# EAGLE design 4current_2te (EAGLE 6.4)
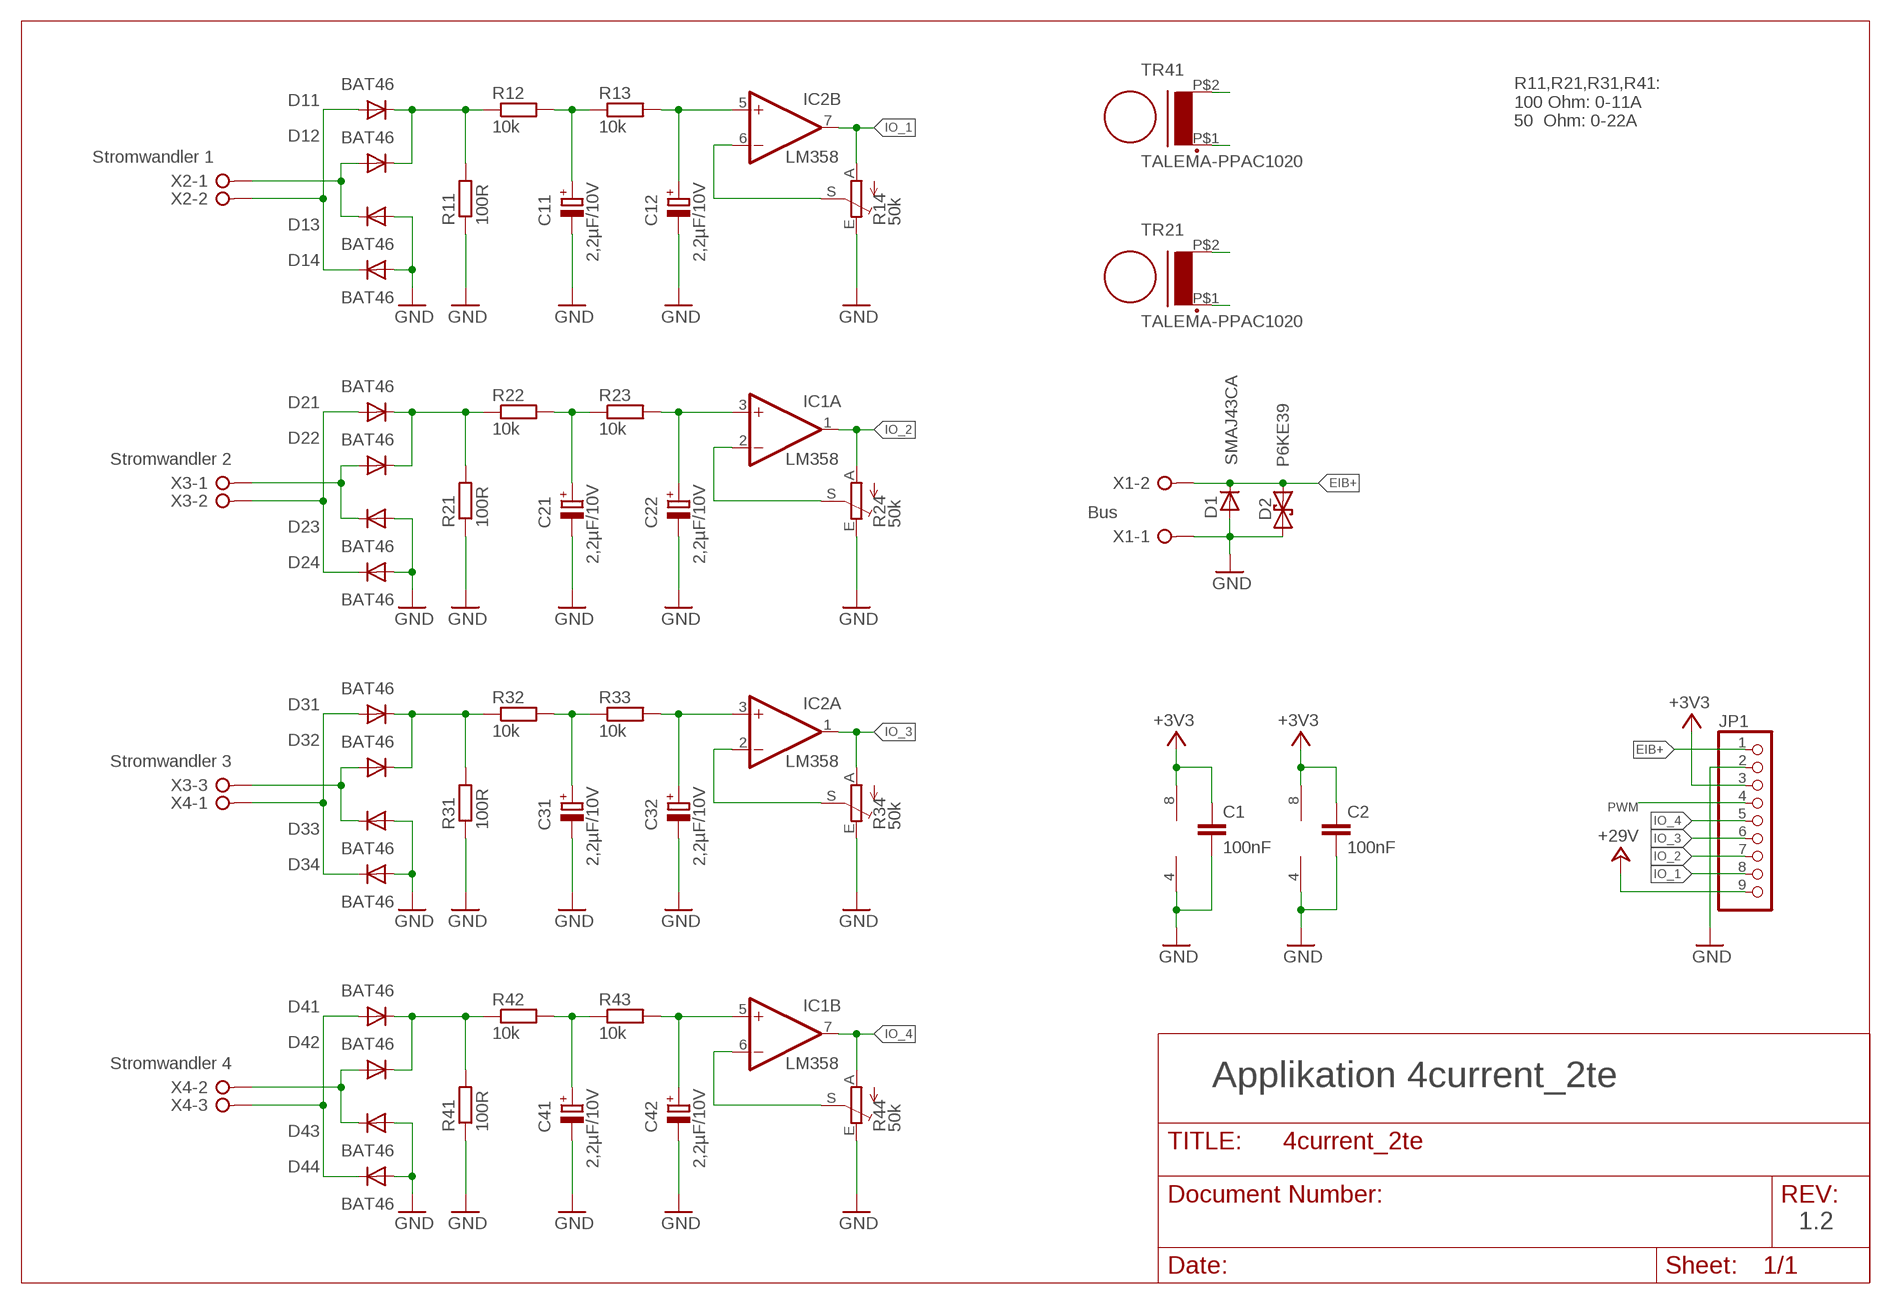
[diagram p0: schematic, sheet 1]

## Parts
C1  100nF  C-EU025-024X044  [C025-024X044]
C2  100nF  C-EU025-024X044  [C025-024X044]
C11  2,2µF/10V  CPOL-EUE2-5  [E2-5]
C12  2,2µF/10V  CPOL-EUE2-5  [E2-5]
C21  2,2µF/10V  CPOL-EUE2-5  [E2-5]
C22  2,2µF/10V  CPOL-EUE2-5  [E2-5]
C31  2,2µF/10V  CPOL-EUE2-5  [E2-5]
C32  2,2µF/10V  CPOL-EUE2-5  [E2-5]
C41  2,2µF/10V  CPOL-EUE2-5  [E2-5]
C42  2,2µF/10V  CPOL-EUE2-5  [E2-5]
D1  SMAJ43CA  D-SOD-87  [SOD87]
D2  P6KE39  P6KEXXCDO41-7  [DO41-7]
D11  BAT46  1N4148DO35-7  [DO35-7]
D12  BAT46  1N4148DO35-7  [DO35-7]
D13  BAT46  1N4148DO35-7  [DO35-7]
D14  BAT46  1N4148DO35-7  [DO35-7]
D21  BAT46  1N4148DO35-7  [DO35-7]
D22  BAT46  1N4148DO35-7  [DO35-7]
D23  BAT46  1N4148DO35-7  [DO35-7]
D24  BAT46  1N4148DO35-7  [DO35-7]
D31  BAT46  1N4148DO35-7  [DO35-7]
D32  BAT46  1N4148DO35-7  [DO35-7]
D33  BAT46  1N4148DO35-7  [DO35-7]
D34  BAT46  1N4148DO35-7  [DO35-7]
D41  BAT46  1N4148DO35-7  [DO35-7]
D42  BAT46  1N4148DO35-7  [DO35-7]
D43  BAT46  1N4148DO35-7  [DO35-7]
D44  BAT46  1N4148DO35-7  [DO35-7]
IC1  LM358  LM358N  [DIL08]
IC2  LM358  LM358N  [DIL08]
JP1  PINHD-1X9  [1X09]
R11  100R  R-EU_0204/7  [0204/7]
R12  10k  R-EU_0204/7  [0204/7]
R13  10k  R-EU_0204/7  [0204/7]
R14  50k  TRIM_EU-B64W  [B64W]
R21  100R  R-EU_0204/7  [0204/7]
R22  10k  R-EU_0204/7  [0204/7]
R23  10k  R-EU_0204/7  [0204/7]
R24  50k  TRIM_EU-B64W  [B64W]
R31  100R  R-EU_0204/7  [0204/7]
R32  10k  R-EU_0204/7  [0204/7]
R33  10k  R-EU_0204/7  [0204/7]
R34  50k  TRIM_EU-B64W  [B64W]
R41  100R  R-EU_0204/7  [0204/7]
R42  10k  R-EU_0204/7  [0204/7]
R43  10k  R-EU_0204/7  [0204/7]
R44  50k  TRIM_EU-B64W  [B64W]
TR21  TALEMA-PPAC1020  [TALEMA_AC]
TR41  TALEMA-PPAC1020  [TALEMA_AC]
X1  W237-02P  [W237-132]
X2  W237-02P  [W237-132]
X3  W237-3E  [W237-3E]
X4  W237-3E  [W237-3E]

## Nets
+3V3: C1.1 C2.1 IC1.8(P:V+) IC2.8(P:V+) JP1.3
+29V: JP1.9
EIB+: D1.1(C) D2.C JP1.1 X1.2
GND: C1.2 C2.2 C11.- C12.- C21.- C22.- C31.- C32.- C41.- C42.- D1.2(A) D2.A D13.A D14.A D23.A D24.A D33.A D34.A D43.A D44.A IC1.4(P:V-) IC2.4(P:V-) JP1.2 R11.1 R14.E R21.1 R24.E R31.1 R34.E R41.1 R44.E X1.1
IO_1: IC2.7(B:OUT) JP1.8 R14.A
IO_2: IC1.1(A:OUT) JP1.7 R24.A
IO_3: IC2.1(A:OUT) JP1.6 R34.A
IO_4: IC1.7(B:OUT) JP1.5 R44.A
N$1: D21.C D22.C R21.2 R22.1
N$2: C21.+ R22.2 R23.1
N$3: C22.+ IC1.3(A:+IN) R23.2
N$4: IC1.2(A:-IN) R24.S
N$5: D31.C D32.C R31.2 R32.1
N$6: C31.+ R32.2 R33.1
N$7: C32.+ IC2.3(A:+IN) R33.2
N$9: D41.C D42.C R41.2 R42.1
N$10: C41.+ R42.2 R43.1
N$11: D11.C D12.C R11.2 R12.1
N$12: C42.+ IC1.5(B:+IN) R43.2
N$13: IC1.6(B:-IN) R44.S
N$14: C11.+ R12.2 R13.1
N$15: C12.+ IC2.5(B:+IN) R13.2
N$16: IC2.2(A:-IN) R34.S
N$18: IC2.6(B:-IN) R14.S
PWM: JP1.4
SENSOR01: TR41.P$2(S4)
SENSOR1_A: D12.A D13.C X2.1
SENSOR1_B: D11.A D14.C X2.2
SENSOR02: TR41.P$1(S3)
SENSOR2_A: D22.A D23.C X3.1
SENSOR2_B: D21.A D24.C X3.2
SENSOR03: TR21.P$2(S4)
SENSOR3_A: D32.A D33.C X3.3
SENSOR3_B: D31.A D34.C X4.1
SENSOR04: TR21.P$1(S3)
SENSOR4_A: D42.A D43.C X4.2
SENSOR4_B: D41.A D44.C X4.3

## Notes on the sheet
- R11,R21,R31,R41:
  100 Ohm: 0-11A
  50  Ohm: 0-22A
- Stromwandler 1
- Stromwandler 2
- Bus
- Stromwandler 3
- Stromwandler 4
- Applikation 4current_2te
- 1.2

## Library data of the parts
C1 C2 = rcl:C-EU: CAPACITOR, European symbol
C11 C12 C21 C22 C31 C32 C41 C42 = rcl:CPOL-EU: POLARIZED CAPACITOR, European symbol
D1 = semicon-smd-ipc:D-: DIODE unfilled
D2 = diode:P6KEXXC: DIODE transient-voltage suppressor
D11-D14 D21-D24 D31-D34 D41-D44 = diode:1N4148: DIODE high speed (Philips)
IC1 IC2 = linear:LM358: OP AMP also LM158; LM258; LM2904 Source: http://cache.national.com/ds/LM/LM158.pdf
JP1 = pinhead:PINHD-1X9: PIN HEADER
R11-R13 R21-R23 R31-R33 R41-R43 = rcl:R-EU_: RESISTOR, European symbol
R14 R24 R34 R44 = pot:TRIM_EU-: POTENTIOMETER
TR21 TR41 = Uwe:TALEMA-PPAC1020
X1 X2 = con-wago-508:W237-02P: WAGO SREW CLAMP; OC_FARNELL: unknown; OC_NEWARK: unknown
X3 X4 = con-wago-508:W237-3E: WAGO SREW CLAMP; OC_FARNELL: unknown; OC_NEWARK: unknown

## Board
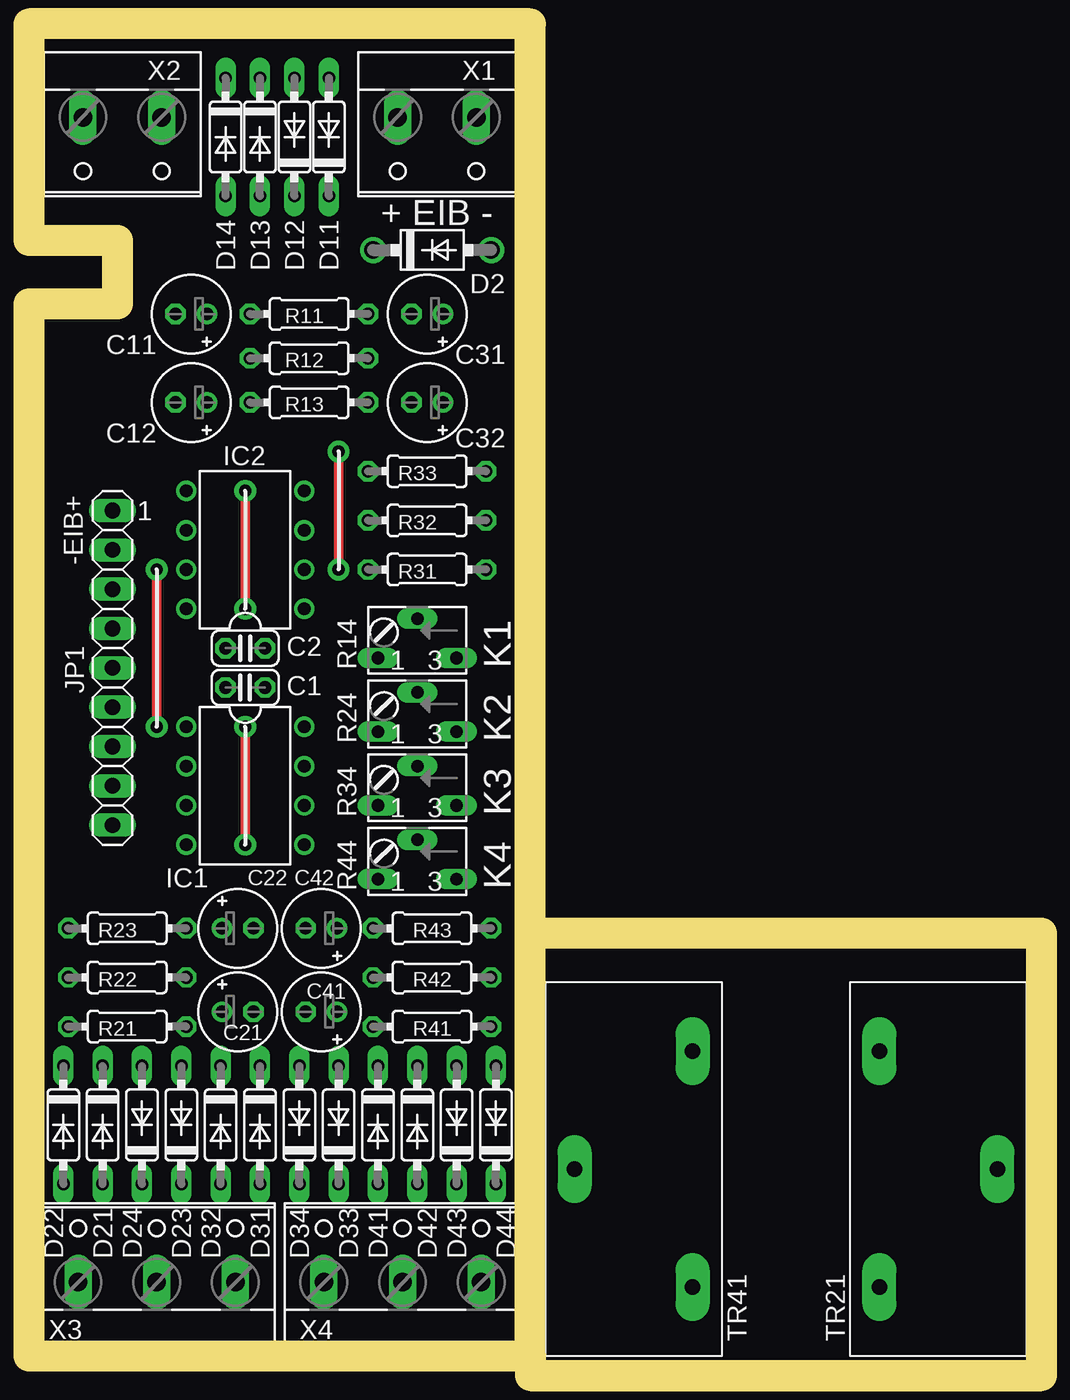
[diagram p1: board, top side]
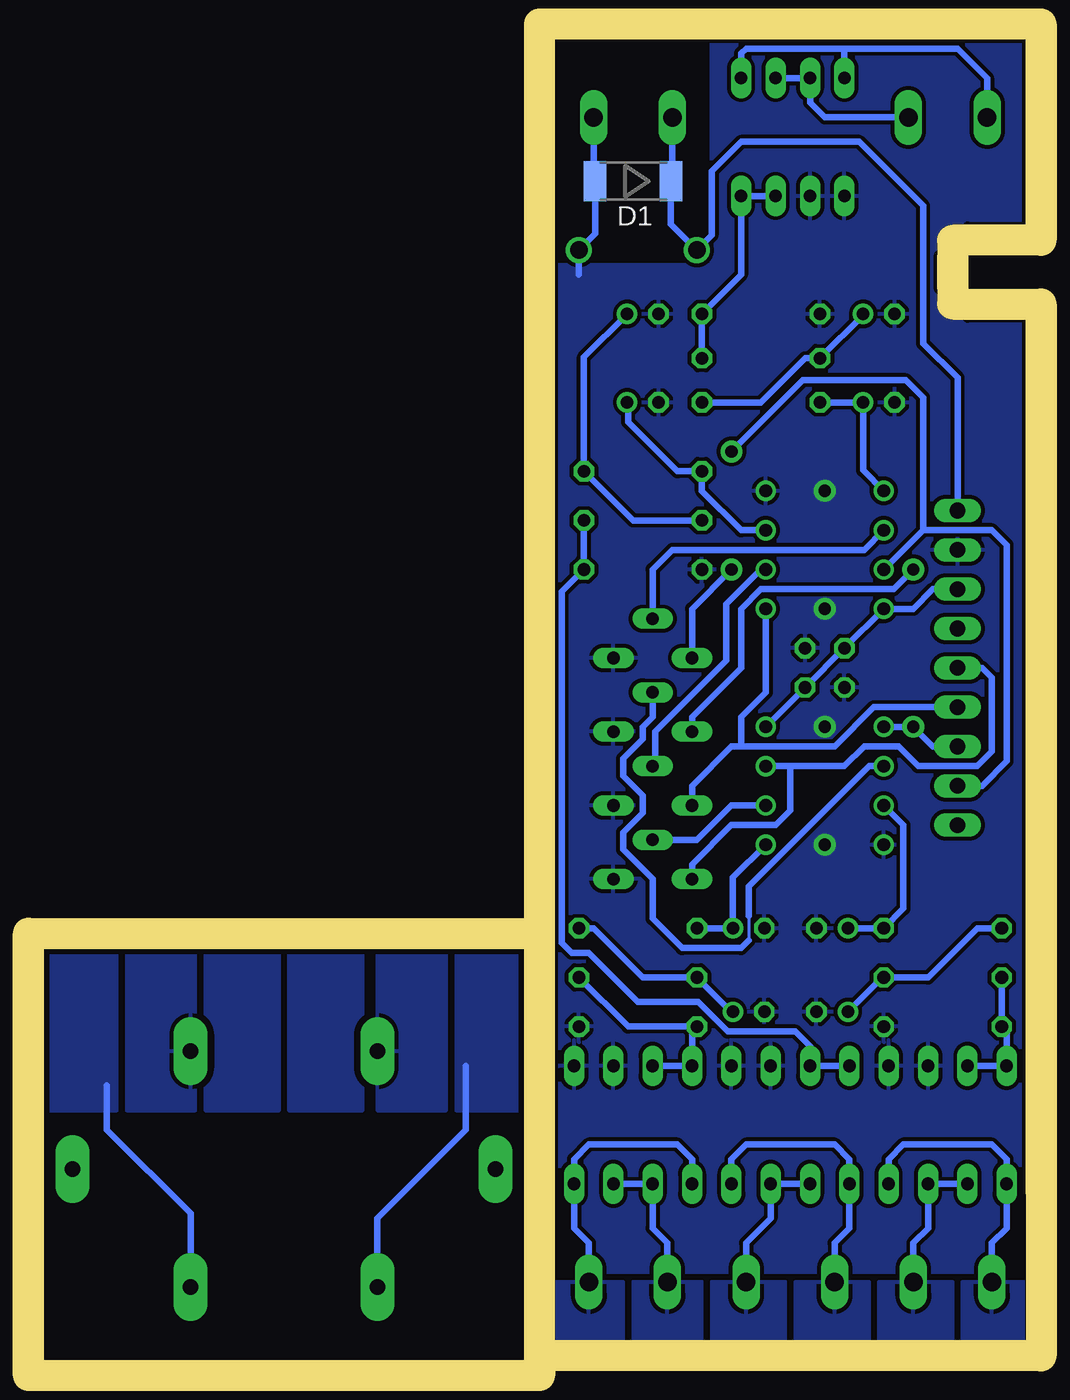
[diagram p2: board, bottom side, seen from below]

Size 63.82 x 85.41 mm. Coordinates in mm from the lower left corner, seen from the top.
Outline: 0,0 0,10.79 0.32,10.79 0.32,67.31 4.13,67.31 6.03,69.22 6.03,71.44 4.13,73.34 0.32,73.34 0.32,85.41 30.8,85.41 30.8,10.79 31.11,10.79 31.11,0 0,0
Outline: 32.7,26.67 63.82,26.67 63.82,0 32.7,0 32.7,26.67
Copper layers (1*16): Top 0.035mm / dielectric 1.5mm / Bottom 0.035mm
Design rules "platinensammler_02 *": minimum track width 0.1mm, minimum drill 0.7mm, track to track 0.252mm, track to pad 0.252mm, pad to pad 0.252mm, via to via 0.252mm, smd to smd 0.252mm, copper to edge 0.2mm, drill to drill 0.2mm, minimum pad ring 0.25mm, minimum via ring 0.3mm, stop-mask expansion 4mil, vias tented up to drill 0.8mm, thermal gap 0.26mm
Milling: 13 lines

### Footprints (pad centres in the part's own frame; a part is rotated, then mirrored left to right if it is on the bottom)
C025-024X044 = drill 0.813 octagon: 1 -1.27,0; 2 1.27,0
E2-5 = drill 0.813 pad 1.27: + -1.016,0 | drill 0.813 pad 1.27 octagon: - 1.016,0
SOD87 = smd 1.45 x 2.6: 1 -2.445,0; 2 2.445,0
DO41-7 = drill 1.118: A 3.81,0; C -3.81,0
DO35-7 = drill 0.813 long: A 3.81,0; C -3.81,0
DIL08 = drill 0.813 pad 1.27: 1 -3.81,-3.81; 2 -1.27,-3.81; 3 1.27,-3.81; 4 3.81,-3.81; 5 3.81,3.81; 6 1.27,3.81; 7 -1.27,3.81; 8 -3.81,3.81
1X09 = drill 1.016 long: 1 -10.16,0; 2 -7.62,0; 3 -5.08,0; 4 -2.54,0; 5 0,0; 6 2.54,0; 7 5.08,0; 8 7.62,0; 9 10.16,0
0204/7 = drill 0.813 octagon: 1 -3.81,0; 2 3.81,0
B64W = drill 0.813 long: A 2.54,0; E -2.54,0; S 0,-2.54
TALEMA_AC = drill 1 pad 2.184 long: P$1 -7.62,-7.62; P$2 7.62,-7.62; P$3 0,0
W237-132 = drill 1.194 long: 1 -2.54,-0.635; 2 2.54,-0.635
W237-3E = drill 1.194 long: 1 -5.08,-0.635; 2 0,-0.635; 3 5.08,-0.635

### Placement (x,y rotation side)
C1  13.34,43.5 180 top
C2  13.34,46.04 0 top
C11  9.84,67.63 180 top
C12  9.84,61.91 180 top
C21  12.86,22.54 0 top
C22  12.86,27.94 0 top
C31  25.08,67.63 180 top
C32  25.08,61.91 180 top
C41  18.26,22.54 180 top
C42  18.26,27.94 180 top
D1  25.72,76.2 180 bottom
D2  25.4,71.75 0 top
D11  18.73,79.06 90 top
D12  16.51,79.06 90 top
D13  14.29,79.06 270 top
D14  12.06,79.06 270 top
D21  4.13,15.24 270 top
D22  1.59,15.24 270 top
D23  9.21,15.24 90 top
D24  6.67,15.24 90 top
D31  14.29,15.24 270 top
D32  11.75,15.24 270 top
D33  19.37,15.24 90 top
D34  16.83,15.24 90 top
D41  21.91,15.24 270 top
D42  24.45,15.24 270 top
D43  26.99,15.24 90 top
D44  29.53,15.24 90 top
IC1  13.34,37.15 270 top
IC2  13.34,52.39 90 top
JP1  4.76,44.77 270 top
R11  17.46,67.63 0 top
R12  17.46,64.77 180 top
R13  17.46,61.91 180 top
R14  24.45,45.4 180 top
R21  5.71,21.59 180 top
R22  5.71,24.77 0 top
R23  5.71,27.94 0 top
R24  24.45,40.64 180 top
R31  25.08,51.12 0 top
R32  25.08,54.29 180 top
R33  25.08,57.47 180 top
R34  24.45,35.88 180 top
R41  25.4,21.59 180 top
R42  25.4,24.77 180 top
R43  25.4,27.94 180 top
R44  24.45,31.11 180 top
TR21  61.91,12.38 270 top
TR41  34.61,12.38 90 top
X1  25.72,79.69 180 top
X2  5.4,79.69 180 top
X3  7.62,5.71 0 top
X4  23.5,5.71 0 top

### Tracks (layer width: path | path; a pad name or v marks a point on that pad's centre or on a via)
+3V3
  Bottom 0.406: IC1.8 C1.1 C2.1 IC2.8 7.62,48.58 6.35,49.85 JP1.3
EIB+
  Bottom 0.406: JP1.1 4.76,63.5 6.99,65.72 6.99,74.61 11.11,78.74 18.73,78.74 20.64,76.83 20.64,72.71 D2.C 23.27,73.44 D1.1 23.18,76.3 X1.2
GND  (via drill 0.8)
  Top 0.61: v13.34,40.96 v13.34,33.34 | v13.34,48.58 v13.34,56.2
  Bottom 0.406: X1.1 28.26,76.3 D1.2 28.16,72.8 D2.A 29.21,70.17
  pour Bottom (isolate 0.254): 0,5.71 30.8,5.71 30.8,70.8 20.64,70.8 20.64,85.41 0.32,85.41 0.32,73.34 5.4,73.34 5.4,67.31 0,67.31
IO_1  (via drill 0.8)
  Top 0.61: v19.37,58.74 v19.37,51.12
  Bottom 0.406: 6.99,53.66 IC2.7 | 6.99,53.66 6.99,62.23 8.1,63.34 14.76,63.34 v19.37,58.74 | JP1.8 3.17,37.15 1.59,38.73 1.59,52.7 2.54,53.66 6.99,53.66 | v19.37,51.12 21.91,48.58 R14.A
IO_2  (via drill 0.8)
  Top 0.61: v7.62,51.12 v7.62,40.96
  Bottom 0.406: v7.62,51.12 8.89,49.85 17.46,49.85 18.73,48.58 18.73,44.77 21.91,41.59 R24.A | IC1.1 v7.62,40.96 6.35,39.69 JP1.7
IO_3
  Bottom 0.406: IC2.1 17.14,43.18 18.73,41.59 18.73,39.69 | JP1.6 10.16,42.23 12.7,39.69 18.73,39.69 | 18.73,39.69 19.37,39.69 21.91,37.15 R34.A
IO_4
  Bottom 0.406: 15.56,38.42 12.06,38.42 10.79,39.69 8.57,39.69 7.3,38.42 3.49,38.42 2.54,39.37 2.54,44.13 3.17,44.77 JP1.5 | 15.56,38.42 IC1.7 | 15.56,38.42 15.56,35.56 16.51,34.61 19.37,34.61 21.91,32.07 R44.A
N$1
  Bottom 0.406: R22.1 R21.2 1.59,21.27 D22.C D21.C
N$2
  Bottom 0.406: C21.+ 9.62,24.77 R22.2 6.67,24.77 3.49,27.94 R23.1
N$3
  Bottom 0.406: IC1.3 8.26,34.61 8.26,31.43 8.26,29.21 R23.2 C22.+
N$4
  Bottom 0.2: 18.26,28.73 18.26,27.15
  Bottom 0.406: IC1.2 10.48,38.42 18.26,30.64 18.26,28.73 | 18.26,27.15 18.73,26.67 22.54,26.67 24.45,28.57 24.45,31.11 26.35,33.02 26.35,34.13 25.08,35.4 25.08,36.51 26.35,37.78 26.35,38.89 25.08,40.16 25.08,40.96 24.45,41.59 R24.S
N$5
  Bottom 0.406: D32.C D31.C 14.29,20.32 15.24,21.27 19.61,21.27 21.51,23.18 25.4,23.18 28.57,26.35 29.69,26.35 30.32,26.99 30.32,49.69 R31.2 R32.1
N$6
  Bottom 0.406: R32.2 25.72,54.29 R33.1 28.89,64.83 C31.+
N$7
  Bottom 0.406: IC2.3 18.73,53.66 21.27,56.2 R33.2 22.86,57.47 26.04,60.64 26.04,61.85 C32.+
N$9
  Bottom 0.406: R42.1 26.04,21.59 R41.2 21.91,21.27 D41.C D42.C
N$10
  Bottom 0.406: C41.+ 19.37,22.54 R42.2 25.08,24.77 28.26,27.94 R43.1
N$11
  Bottom 0.406: D12.C D11.C 18.73,70.17 R11.2 R12.1
N$12
  Bottom 0.406: IC1.5 19.27,31.21 C42.+ R43.2
N$13
  Bottom 0.406: IC1.6 19.37,35.88 21.59,33.66 R44.S
N$14
  Bottom 0.406: C11.+ 10.86,67.56 R12.2 14.61,64.77 17.46,61.91 R13.1
N$15
  Bottom 0.406: IC2.5 10.86,57.53 C12.+ R13.2
N$16
  Bottom 0.406: IC2.2 17.46,51.12 19.68,48.9 19.68,45.24 24.29,40.64 24.29,38.58 R34.S
N$18
  Bottom 0.406: IC2.6 10.79,52.39 23.18,52.39 24.45,51.12 R14.S
N$19
  pour Bottom (isolate 0.406): 43.18,26.67 47.94,26.67 47.94,16.19 43.18,16.19
N$20
  pour Bottom (isolate 0.406): 48.58,26.67 53.34,26.67 53.34,16.19 48.58,16.19
SENSOR01
  pour Bottom (isolate 0.406): 37.78,26.67 42.23,26.67 42.23,16.19 37.78,16.19
SENSOR1_A
  Bottom 0.406: D12.A D13.C 14.29,81.28 13.34,80.33 X2.1
SENSOR1_B
  Bottom 0.406: 12.06,84.77 4.76,84.77 2.86,82.87 X2.2 | 12.06,84.77 18.41,84.77 18.73,84.45 D11.A | D14.C 12.06,84.77
SENSOR02
  Bottom 0.406: TR41.P$1 42.23,9.21 36.51,14.92 36.51,19.05
  pour Bottom (isolate 0.406): 32.7,26.67 37.15,26.67 37.15,16.19 32.7,16.19
SENSOR2_A
  Bottom 0.406: D23.C 9.21,13.02 8.26,13.97 2.54,13.97 1.59,13.02 D22.A 1.59,8.57 2.54,7.62 X3.1
  pour Bottom (isolate 0.406): 4.45,5.08 4.45,0 0,0 0,5.08
SENSOR2_B
  Bottom 0.406: D21.A D24.C 6.67,8.57 7.62,7.62 X3.2
  pour Bottom (isolate 0.406): 5.08,5.08 9.84,5.08 9.84,0 5.08,0
SENSOR03
  Bottom 0.406: TR21.P$2 54.29,9.53 59.69,14.92 59.69,17.78
  pour Bottom (isolate 0.406): 59.05,26.67 63.82,26.67 63.82,16.19 59.05,16.19
SENSOR3_A
  Bottom 0.406: D33.C 19.37,13.02 18.41,13.97 12.7,13.97 11.75,13.02 D32.A 11.75,8.57 12.7,7.62 X3.3
  pour Bottom (isolate 0.406): 10.48,5.08 15.24,5.08 15.24,0 10.48,0
SENSOR3_B
  Bottom 0.406: D31.A D34.C 16.83,9.21 18.41,7.62 X4.1
  pour Bottom (isolate 0.406): 15.88,5.08 20.64,5.08 20.64,0 15.88,0
SENSOR04
  pour Bottom (isolate 0.406): 53.98,26.67 58.42,26.67 58.42,16.19 53.98,16.19
SENSOR4_A
  Bottom 0.406: D43.C D42.A 24.45,8.57 23.5,7.62 X4.2
  pour Bottom (isolate 0.406): 21.27,5.08 25.72,5.08 25.72,0 21.27,0
SENSOR4_B
  Bottom 0.406: D41.A 21.91,13.02 22.86,13.97 28.57,13.97 29.53,13.02 D44.C 29.53,8.57 28.57,7.62 X4.3
  pour Bottom (isolate 0.406): 26.35,5.08 31.11,5.08 31.11,0 26.35,0

### Text on the board
tNames: + EIB - | 1 | -EIB+ | K1 | K2 | K3 | K4
DrillLegend: LAYER-STACK
DrillLegend_01-16: 01-16